# EasyEDA Pro project alan.eprj

# Schematic Schematic1
Board Name: Board1; Create Date: 2026-04-02; Page Name: P1; Project Name: alan; Schematic Name: Schematic1; Update Date: 2026-05-09; Company: EasyEDA.com; Page Size: A4; Version: V1.0
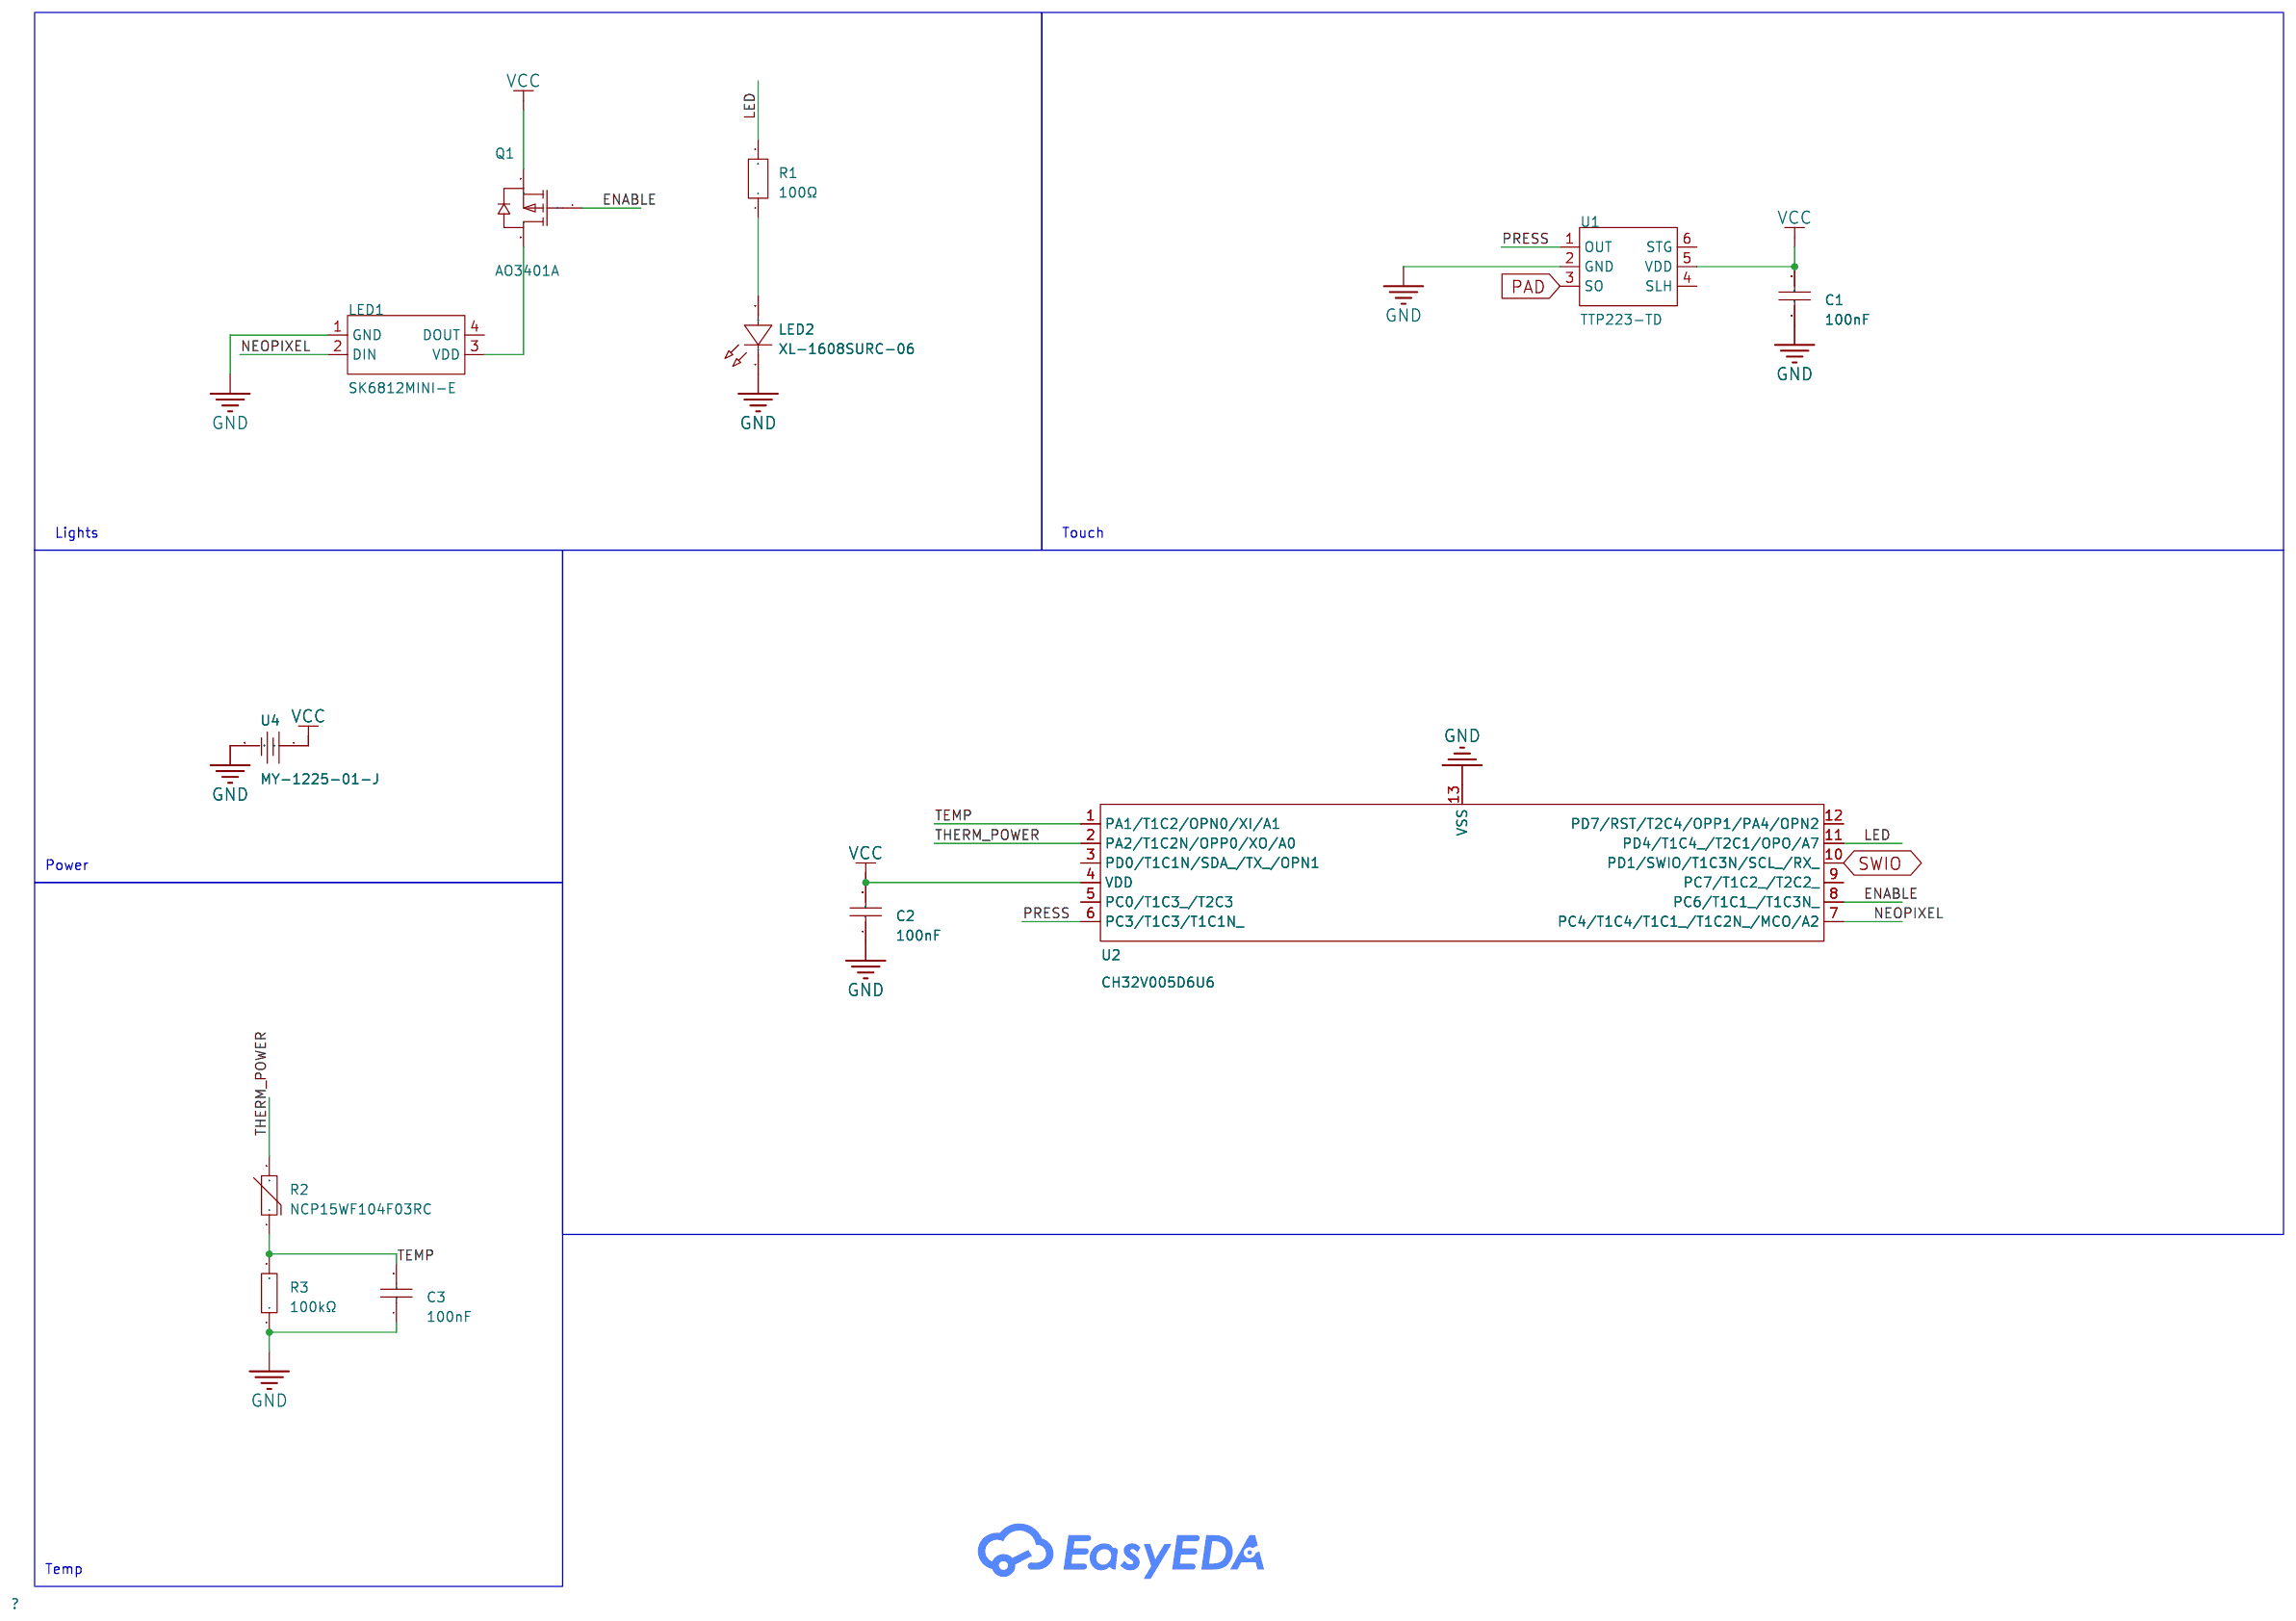
[diagram p0: schematic sheet]

## Parts
C1  100nF  [C0402]
C2  100nF  [C0402]
C3  100nF  [C0402]
LED1  SK6812MINI-E  [LED-SMD_4P-L3.2-W2.8-LS5.9_SK6812MINI-E]
LED2  XL-1608SURC-06  [LED0603-RD_RED]
Q1  AO3401A  [SOT-23_L2.9-W1.3-P1.90-LS2.4-BR]
R1  100Ω  [R0402]
R2  NCP15WF104F03RC  [R0402]
R3  100kΩ  [R0402]
U1  TTP223-TD  [SOT-23-6_L2.9-W1.6-P0.95-LS2.9-BL]
U2  CH32V005D6U6  [QFN-12_L2.0-W2.0-P0.40-TL-EP1.1-1]
U4  MY-1225-01-J  [BAT-SMD_MY-1225-01-J]

## Library data of the parts
C1-C3 = CC0402KRX7R9BB104: LCSC Part Name: 100nF ±10% 50V; Supplier Part: C131394; Manufacturer: YAGEO(国巨); Supplier Footprint: 0402; JLCPCB Part Class: Extended Part; Datasheet: https://atta.szlcsc.com/upload/public/pdf/source/20181008/C309510_22F155564471FAF6A489F7D68F34234E.pdf; Supplier: LCSC; Tolerance: ±10%
LED1 = SK6812MINI-E_C5149201: Supplier Part: C5149201; Manufacturer: 欧思科光电; Supplier Footprint: SMD; JLCPCB Part Class: Extended Part; Datasheet: https://item.szlcsc.com/datasheet/SK6812MINI-E/5773397.html; Supplier: LCSC
LED2 = XL-1608SURC-06: LCSC Part Name: 0603红色贴片式发光二极管; Supplier Part: C965799; Manufacturer: XINGLIGHT(成兴光); Supplier Footprint: 0603; JLCPCB Part Class: Extended Part; Datasheet: https://item.szlcsc.com/datasheet/XL-1608SURC-06/1051408.html; Supplier: LCSC; Illumination Color: Red; Voltage - Forward(Vf): 2.3V; Power(Watts): 50mW; Forward Current: 20mA; Wavelength - Dominant: 620nm~630nm; Peak Wavelength: 625nm; Diode Configuration: Discrete Diode; Lens Color: Water Clear; Luminous Intensity: 225mcd; Viewing Angle: 120°; Mounting Style: Top-mount; Operating Temperature: -40℃~+85℃
Q1 = AO3401A_C15127: LCSC Part Name: 1个P沟道 耐压:30V 电流:4A; Supplier Part: C15127; Manufacturer: AOS; Supplier Footprint: SOT-23; JLCPCB Part Class: Basic Part; Datasheet: https://item.szlcsc.com/datasheet/AO3401A/15801.html; Supplier: LCSC; Number: 1 P-Channel; Drain to Source Voltage: 30V; Current - Continuous Drain(Id): 4A; RDS(on): 47mΩ@10V；85mΩ@2.5V；60mΩ@4.5V; Gate Threshold Voltage (Vgs(th)): 900mV@250uA; Gate Charge(Qg): 14nC@10V; Input Capacitance(Ciss): 645pF; Reverse Transfer Capacitance (Crss@Vds): 55pF; Output Capacitance(Coss): 80pF
R1 = ERJ2RKF1000X: LCSC Part Name: 100Ω ±1% 100mW 厚膜电阻; Supplier Part: C413063; Manufacturer: PANASONIC(松下); Supplier Footprint: 0402; JLCPCB Part Class: Extended Part; Datasheet: https://atta.szlcsc.com/upload/public/pdf/source/20190820/C413063_95D61CC78C57CA6EC5636452389D6E3B.pdf; Supplier: LCSC; Type: Thick Film Resistors; Tolerance: ±1%; Temperature Coefficient: ±100ppm/℃; Operating Temperature Range: -55℃~+155℃
R2 = NCP15WF104F03RC: LCSC Part Name: 100kΩ 4250K 100mW; Supplier Part: C77130; Manufacturer: muRata(村田); Supplier Footprint: 0402; JLCPCB Part Class: Extended Part; Datasheet: https://item.szlcsc.com/datasheet/NCP15WF104F03RC/78257.html; Supplier: LCSC; Resistance @ 25℃: 100kΩ; B Constant (25℃/50℃): 4250K; Resistance Tolerance: ±1%; B Constant (25℃/85℃): 4311K; B Constant (25℃/100℃): 4334K; Power(Watts): 100mW; B Constant Tolerance: ±1%; Steady State Current (Max): 100uA; Operating Temperature: -40℃~+125℃; Dissipation Factor: 1mW/℃; Length: 1mm; Width: 0.5mm
R3 = RC0402FR-07100KL: LCSC Part Name: 厚膜电阻 100kΩ ±1% 62.5mW; Supplier Part: C60491; Manufacturer: YAGEO(国巨); Supplier Footprint: 0402; JLCPCB Part Class: Extended Part; Datasheet: https://item.szlcsc.com/datasheet/RC0402FR-07100KL/61543.html; Supplier: LCSC; Type: Thick Film Resistor; Tolerance: ±1%; Power(Watts): 62.5mW; Voltage-Supply(Max): 50V; Temperature Coefficient: ±100ppm/℃; Operating Temperature: -55℃~+155℃
U1 = TTP223-TD: Supplier Part: C42422128; Manufacturer: TDSEMIC(拓电半导体); Supplier Footprint: SOT-23-6; JLCPCB Part Class: Extended Part; Datasheet: https://item.szlcsc.com/datasheet/TTP223-TD/44440381.html; Supplier: LCSC; Number of Channels: 1; Voltage - Supply: 2V~5.5V; Current - Supply: 3.5uA
U2 = CH32V005D6U6: LCSC Part Name: 基于青稞RISC-V内核的工业级通用微控制器; Supplier Part: C49006243; Manufacturer: WCH(南京沁恒); Supplier Footprint: QFN-12(2x2); JLCPCB Part Class: Extended Part; Datasheet: https://item.szlcsc.com/datasheet/CH32V005D6U6/51358930.html; Supplier: LCSC
U4 = MY-1225-01-J: LCSC Part Name: MYOUNG(美阳)电池扣CR1225-N Ni SMT卧式自动化生产贴片电池底座/耐高温材质/DIP焊接工艺标准 适配1225电池; Supplier Part: C20606803; Manufacturer: MYOUNG(美阳); JLCPCB Part Class: Extended Part; Datasheet: https://item.szlcsc.com/datasheet/MY-1225-01-J/21949520.html; Supplier: LCSC; Type: Battery buckle; Contact material: Phosphor bronze; Contact coating: Nickel plated; Applicable battery specifications: CR1225

## Nets
GND: C1.1 C2.1 C3.1 LED1.1(GND) LED2.1(K) R3.1 U1.2(GND) U2.13(VSS) U4.2
VCC: C1.2 C2.2 Q1.2(S) U1.5(VDD) U2.4(VDD) U4.1
ENABLE: Q1.1(G) U2.8(PC6/T1C1_/T1C3N_)
LED: R1.2 U2.11(PD4/T1C4_/T2C1/OPO/A7)
NEOPIXEL: LED1.2(DIN) U2.7(PC4/T1C4/T1C1_/T1C2N_/MCO/A2)
PAD: U1.3(SO)
PRESS: U1.1(OUT) U2.6(PC3/T1C3/T1C1N_)
SWIO: U2.10(PD1/SWIO/T1C3N/SCL_/RX_)
TEMP: C3.2 R2.1 R3.2 U2.1(PA1/T1C2/OPN0/XI/A1)
THERM_POWER: R2.2 U2.2(PA2/T1C2N/OPP0/XO/A0)
$1N2084: LED1.3(VDD) Q1.3(D)
$1N3150: LED2.2(A) R1.1

Not connected (* = marked no-connect by the designer): LED1 4(DOUT); U1 4(SLH) 6(STG); U2 3(PD0/T1C1N/SDA_/TX_/OPN1) 5(PC0/T1C3_/T2C3) 9(PC7/T1C2_/T2C2_) 12(PD7/RST/T2C4/OPP1/PA4/OPN2)

## Notes on the sheet
- Lights
- Touch
- Power
- Temp

# Board PCB1
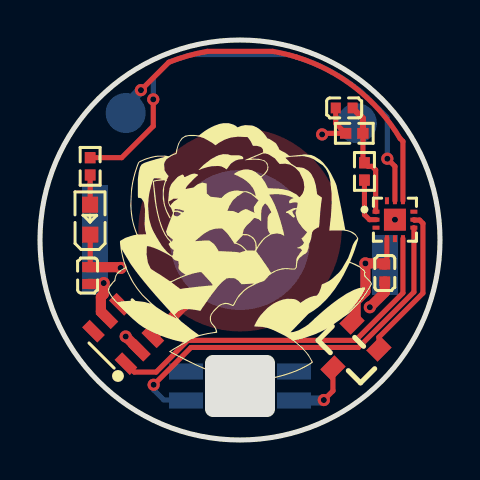
[diagram p1: board, top side]
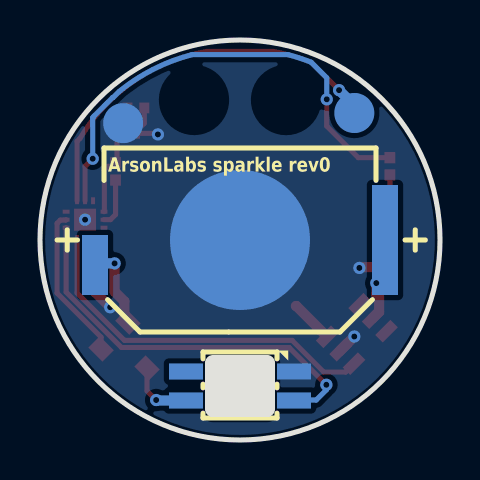
[diagram p2: board, bottom side, seen from below]

Outline 20 x 20 mm; copper layers: Top Layer, Bottom Layer. Coordinates in mm from the lower left corner of the outline.
Outline path: circle c10,10 r10
Stack: Top Layer 0.035mm / Dielectric1 1.51mm FR4 er 4.5 / Bottom Layer 0.035mm

## Design rules (mm)
template: Custom Config
spacing copperThickness1oz (default): track to track 0.102, other pairs 0.152 to 0.3
spacing copperThickness2oz: track to track 0.203, other pairs 0.152 to 0.3
track width copperThickness1oz (default): min 0.127, default 0.254, max 2.54
track width copperThickness2oz: min 0.203, default 0.254, max 2.54
differential pair differentialPair (default): width min 0.127, default 0.254, max 2.54; gap min 0.152, default 0.152
via viaSize (default): diameter min 0.5, default 0.61, max 10; hole min 0.3, default 0.305, max 6.3

## Placement (name value [footprint] x y rotation side)
C1  100nF  [C0402]  2.38 8.22 270 top
C2  100nF  [C0402]  17.24 8.35 90 top
C3  100nF  [C0402]  15.21 16.6 0 top
LED1  SK6812MINI-E  [LED-SMD_4P-L3.2-W2.8-LS5.9_SK6812MINI-E]  10 2.7 0 bottom
LED2  XL-1608SURC-06  [LED0603-RD_RED]  2.51 11.02 90 top
NOREF  -  [Pad_e1498]  15.84 15.84 0 top
NOREF#2  -  [Pad_e1470]  4.28 16.35 0 top
Q1  AO3401A  [SOT-23_L2.9-W1.3-P1.90-LS2.4-BR]  15.46 4.41 45 top
R1  100Ω  [R0402]  2.51 13.68 90 top
R2  NCP15WF104F03RC  [R0402]  16.22 13.43 270 top
R3  100kΩ  [R0402]  15.72 15.33 0 top
U1  TTP223-TD  [SOT-23-6_L2.9-W1.6-P0.95-LS2.9-BL]  4.16 5.3 45 top
U2  CH32V005D6U6  [QFN-12_L2.0-W2.0-P0.40-TL-EP1.1-1]  17.75 11.02 0 top
U4  MY-1225-01-J  [BAT-SMD_MY-1225-01-J]  10 10 0 bottom

## Footprints (pads in the part's own frame, mm; a bottom-side part is the same pattern mirrored in y, then rotated)
BAT-SMD_MY-1225-01-J
  rect 1.3x5.5 smd: 1(-7.25,0)
  rect 1.3x3 smd: 1(7.25,1.25)
  round 7 smd: 2(0,0)
C0402
  rect 0.5x0.54 smd: 1(-0.42,0) 2(0.42,0)
LED0603-RD_RED
  rect 0.8x0.8 smd: 1(-0.749,-0.004) 2(0.749,0.004)
LED-SMD_4P-L3.2-W2.8-LS5.9_SK6812MINI-E
  rect 1.7x0.8 smd: 1(-2.7,-0.725) 2(-2.7,0.725) 3(2.7,0.725) 4(2.7,-0.725)
Pad_e1470
  round 2 smd far side: TP1(0,0)
Pad_e1498
  round 2 smd far side: TP1(0,0)
QFN-12_L2.0-W2.0-P0.40-TL-EP1.1-1
  rect 0.345x0.2 smd: 1(-0.948,0.4) 2(-0.948,0) 3(-0.948,-0.4) 7(0.948,-0.4) 8(0.948,0) 9(0.948,0.4)
  rect 0.2x0.345 smd: 4(-0.4,-0.948) 5(0,-0.948) 6(0.4,-0.948) 10(0.4,0.948) 11(0,0.948) 12(-0.4,0.948)
  rect 1.1x1.1 smd: 13(0,0)
R0402
  rect 0.566x0.54 smd: 1(-0.433,0) 2(0.433,0)
SOT-23-6_L2.9-W1.6-P0.95-LS2.9-BL
  rect 0.532x1.072 smd: 1(-0.95,-1.149) 2(0,-1.149) 3(0.95,-1.149) 4(0.95,1.149) 5(0,1.149) 6(-0.95,1.149)
SOT-23_L2.9-W1.3-P1.90-LS2.4-BR
  rect 1x0.8 smd: 1(1.15,-0.95) 2(1.15,0.95) 3(-1.15,0)

## Nets
As in the schematic, except:
GND: C1.1 C2.1 C3.1 LED1.1 LED2.1 NOREF.TP1 R3.1 U1.2 U2.13 U4.2
SWIO: NOREF#2.TP1 U2.10

Pads without a net: LED1 4; U1 4 6; U2 3 5 9 12

## Via types
v1: diameter 0.61, hole 0.305, Top Layer to Bottom Layer, 12 vias

## Routing (per net, layer and track width the routed paths; a pad name or vN(x,y) marks a point on that pad's centre or on a via; arc(x,y) is an arc through that point)
GND: length 8.6
  Top Layer w0.254: C1.1 2.51,8.77 LED2.1 ; C3.1 14.79,15.83 R3.1 14.16,15.33 v1(14.11,15.28)
  Top Layer w0.508: C2.1 17.24,7.39 v1(16.49,6.64) ; C1.1 3.99,8.64 v1(4.03,8.6) ; v1(4.28,5.17) U1.2
  vias: v1(17.75,11.02)
VCC: length 9.3
  Top Layer w0.254: U2.4 17.35,8.88 C2.2
  Top Layer w0.508: C2.2 17.18,8.83 v1(16.27,8.83) 16.27,7.42 15.78,6.93 15.78,6.08 Q1.2 ; C1.2 3.14,7.8 v1(3.19,7.85) 3.19,7.29 3.04,7.14 3.04,6.42 U1.5
  Bottom Layer w0.508: U4.1 17.17,8.83 v1(16.27,8.83)
ENABLE: length 7.7
  Top Layer w0.254: U2.8 18.72,11 18.98,11 19.15,10.83 19.15,7.34 16.95,5.14 Q1.1
LED: length 23.8
  Top Layer w0.254: U2.11 17.75,13.68 v1(17.37,14.06) ; R1.2 4.08,14.12 5.66,15.7 v1(5.66,17.03)
  Bottom Layer w0.254: 5.74,17.11 v1(5.66,17.03) 5.66,18.11 6.44,18.89 arc(7.02,19.1) 7.61,19.27 12.39,19.27 arc(14.31,18.55) 16.04,17.43 16.35,17.12 16.37,17.12 17.3,16.19 arc(17.33,16.15) 17.37,16.11 v1(17.37,14.06)
NEOPIXEL: length 19.9
  Top Layer w0.254: U2.7 18.69,7.4 15.92,4.63 7.55,4.63 v1(5.68,2.76)
  Bottom Layer w0.254: v1(5.68,2.76) 5.68,2.51 6.19,2 6.96,2
PAD: length 2.2
  Top Layer w0.508: U1.3 7.18,6.7 7.21,6.7
PRESS: length 18.4
  Top Layer w0.254: U2.6 18.15,7.35 15.78,4.98 7.39,4.98 5.81,3.4 4.72,3.4 4.3,3.82
SWIO: length 20.1
  Top Layer w0.254: v1(5.05,17.49) 6.44,18.89 arc(7.39,19.21) 8.37,19.43 11.63,19.43 arc(12.24,19.31) 12.83,19.14 arc(15.79,17.59) 18,15.08 18.15,14.93 U2.10
  Bottom Layer w0.508: v1(5.05,17.49) 4.28,16.73 4.28,16.1
TEMP: length 5.8
  Top Layer w0.254: R3.2 16.15,13.94 R2.1 16.4,13.68 16.6,13.68 16.78,13.5 16.78,11.43 U2.1
  Top Layer w0.305: R3.2 16.15,16.08 15.63,16.6
THERM_POWER: length 2.4
  Top Layer w0.254: U2.2 16.48,11.02 16.22,11.27 R2.2
$1N2084: length 3.3
  Top Layer w0.254: 14.65,3.6 14.65,2.46 v1(14.19,2)
  Bottom Layer w0.508: LED1.3 14.17,1.97 v1(14.19,2)
$1N3150: length 1.5
  Top Layer w0.254: LED2.2 2.51,11.77 R1.1

## Copper pours and planes (outline as drawn; the poured copper is in the pictures)
GND on Bottom Layer: -3.59,23.08 24.35,23.08 24.35,-2.95 -3.59,-2.95
PAD on Top Layer: 15.08,10.73 15.04,11.17 14.96,11.61 14.84,12.04 14.69,12.45 14.51,12.85 14.28,13.24 14.03,13.6 13.75,13.94 13.43,14.25 13.09,14.54 12.73,14.79 12.35,15.01 11.94,15.2 11.53,15.35 11.1,15.47 10.66,15.54 10.22,15.58 9.78,15.58 9.34,15.54 8.9,15.47 8.47,15.35 8.06,15.2 7.65,15.01 7.27,14.79 6.91,14.54 6.57,14.25 6.25,13.94 5.97,13.6 5.72,13.24 5.49,12.85 5.31,12.45 5.16,12.04 5.04,11.61 4.96,11.17 4.92,10.73 4.92,10.29 4.96,9.84 5.04,9.41 5.16,8.98 5.31,8.56 5.49,8.16 5.72,7.78 5.97,7.42 6.25,7.08 6.57,6.76 6.91,6.48 7.27,6.22 7.65,6 8.06,5.81 8.47,5.66 8.9,5.55 9.34,5.47 9.78,5.43 10.22,5.43 10.66,5.47 11.1,5.55 11.53,5.66 11.94,5.81 12.35,6 12.73,6.22 13.09,6.48 13.43,6.76 13.75,7.08 14.03,7.42 14.28,7.78 14.51,8.16 14.69,8.56 14.84,8.98 14.96,9.41 15.04,9.84 15.08,10.29

## Text on the board
Bottom Silkscreen Layer: ArsonLabs sparkle rev0
